# Altium schematic sheet IQ_Demod.SchDoc
size B; SheetNumber: 4; SheetTotal: 15
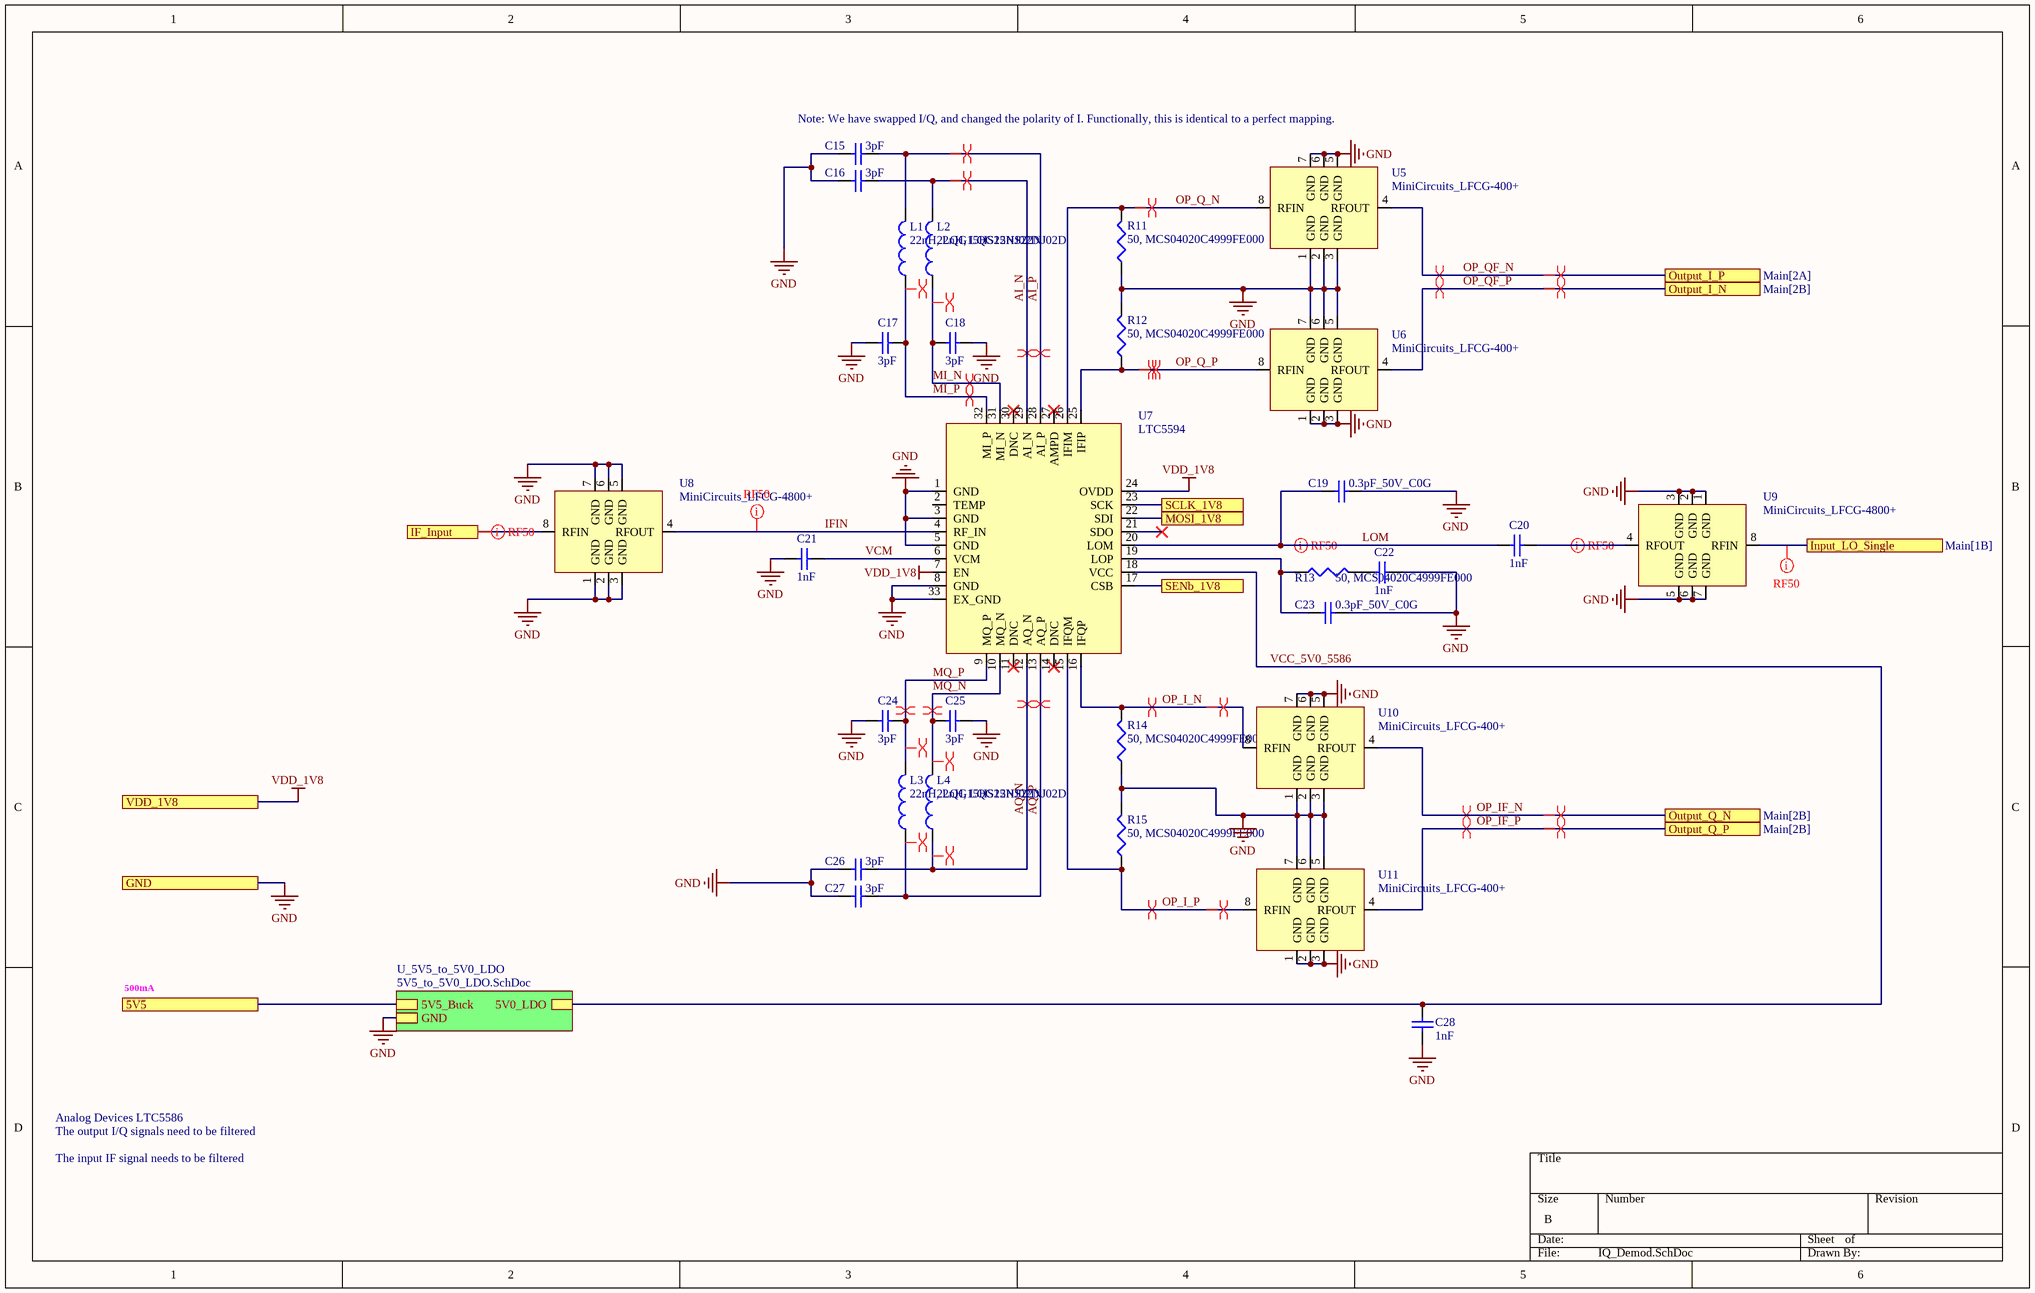
[diagram p0: IQ_Demod.SchDoc]

## Parts
C15  3pF  [Johanson-0201]
C16  3pF  [Johanson-0201]
C17  3pF  [Johanson-0201]
C18  3pF  [Johanson-0201]
C19  0.3pF_50V_C0G  [SMD-0402]
C20  1nF  [SMD-0402]
C21  1nF  [SMD-0402]
C22  1nF  [SMD-0402]
C23  0.3pF_50V_C0G  [SMD-0402]
C24  3pF  [Johanson-0201]
C25  3pF  [Johanson-0201]
C26  3pF  [Johanson-0201]
C27  3pF  [Johanson-0201]
C28  1nF  [SMD-0402]
L1  22nH, LQG15HS22NJ02D  [SMD-0402]
L2  22nH, LQG15HS22NJ02D  [SMD-0402]
L3  22nH, LQG15HS22NJ02D  [SMD-0402]
L4  22nH, LQG15HS22NJ02D  [SMD-0402]
R11  50, MCS04020C4999FE000  [SMD-0402]
R12  50, MCS04020C4999FE000  [SMD-0402]
R13  50, MCS04020C4999FE000  [SMD-0402]
R14  50, MCS04020C4999FE000  [SMD-0402]
R15  50, MCS04020C4999FE000  [SMD-0402]
U5  MiniCircuits_LFCG-400+  [MiniCircuits LFCG-1400+]
U6  MiniCircuits_LFCG-400+  [MiniCircuits LFCG-1400+]
U7  LTC5594  [LTC5594]
U8  MiniCircuits_LFCG-4800+  [MiniCircuits LFCG-1400+]
U9  MiniCircuits_LFCG-4800+  [MiniCircuits LFCG-1400+]
U10  MiniCircuits_LFCG-400+  [MiniCircuits LFCG-1400+]
U11  MiniCircuits_LFCG-400+  [MiniCircuits LFCG-1400+]

## Sub-sheets
U_5V5_to_5V0_LDO = 5V5_to_5V0_LDO.SchDoc: 5V5_Buck, GND, 5V0_LDO

## Ports
5V5 (see Main[1B], Buck_TPSM82913_5V5[5B]), GND (see Main[2B], 3V7_to_3V3_LDO[1B], 5V5_to_5V0_LDO[1C], Buck_TPSM82913_1V8[3C], Buck_TPSM82913_3V7[3C], Buck_TPSM82913_5V0[3C], Buck_TPSM82913_5V5[2C], Clocking_and_LO[2A], Fan_Interfaces[2B], IQ_Mod[1B], LMX2820[4D], Microzed_Interfaces[1A], Power_Supply[6B], Voltage_Conv_Bidirectional[1B]), IF_Input (see Main[1A]), Input_LO_Single (see Main[1B]), MOSI_1V8 (see Main[1B]), Output_I_N (see Main[2B]), Output_I_P (see Main[2A]), Output_Q_N (see Main[2B]), Output_Q_P (see Main[2B]), SCLK_1V8 (see Main[1B]), SENb_1V8 (see Main[1B]), VDD_1V8 (see Main[1B])

## Nets
GND: C15.1 C16.1 C17.1 C18.2 C19.2 C21.2 C22.1 C23.2 C24.1 C25.2 C26.1 C27.1 C28.2 R11.1 R12.2 R14.1 R15.2 U5.1(GND) U5.2(GND) U5.3(GND) U5.5(GND) U5.6(GND) U5.7(GND) U6.1(GND) U6.2(GND) U6.3(GND) U6.5(GND) U6.6(GND) U6.7(GND) U7.1(GND) U7.3(GND) U7.5(GND) U7.8(GND) U7.33(EX_GND) U8.1(GND) U8.2(GND) U8.3(GND) U8.5(GND) U8.6(GND) U8.7(GND) U9.1(GND) U9.2(GND) U9.3(GND) U9.5(GND) U9.6(GND) U9.7(GND) U10.1(GND) U10.2(GND) U10.3(GND) U10.5(GND) U10.6(GND) U10.7(GND) U11.1(GND) U11.2(GND) U11.3(GND) U11.5(GND) U11.6(GND) U11.7(GND) ; port GND, sheet U_5V5_to_5V0_LDO/GND
VDD_1V8: U7.7(EN) U7.24(OVDD) ; port VDD_1V8
5V5: port 5V5, sheet U_5V5_to_5V0_LDO/5V5_Buck
AI_N: C16.2 L2.2 U7.29(AI_N)
AI_P: C15.2 L1.2 U7.28(AI_P)
AQ_N: C26.2 L4.1 U7.12(AQ_N)
AQ_P: C27.2 L3.1 U7.13(AQ_P)
IF_Input: U8.8(RFIN) ; port IF_Input
IFIN: U7.4(RF_IN) U8.4(RFOUT)
Input_LO_Single: U9.8(RFIN) ; port Input_LO_Single
LOM: C19.1 C20.2 U7.20(LOM)
MI_N: C18.1 L2.1 U7.31(MI_N)
MI_P: C17.2 L1.1 U7.32(MI_P)
MOSI_1V8: U7.22(SDI) ; port MOSI_1V8
MQ_N: C25.1 L4.2 U7.10(MQ_N)
MQ_P: C24.2 L3.2 U7.9(MQ_P)
OP_I_N: R14.2 U7.16(IFQP) U10.8(RFIN)
OP_I_P: R15.1 U7.15(IFQM) U11.8(RFIN)
OP_IF_N: U10.4(RFOUT) ; port Output_Q_N
OP_IF_P: U11.4(RFOUT) ; port Output_Q_P
OP_Q_N: R11.2 U5.8(RFIN) U7.26(IFIM)
OP_Q_P: R12.1 U6.8(RFIN) U7.25(IFIP)
OP_QF_N: U5.4(RFOUT) ; port Output_I_P
OP_QF_P: U6.4(RFOUT) ; port Output_I_N
SCLK_1V8: U7.23(SCK) ; port SCLK_1V8
SENb_1V8: U7.17(CSB) ; port SENb_1V8
VCC_5V0_5586: C28.1 U7.18(VCC) ; sheet U_5V5_to_5V0_LDO/5V0_LDO
VCM: C21.1 U7.6(VCM)
NetC20_1: C20.1 U9.4(RFOUT)
NetC22_2: C22.2 R13.2
NetC23_1: C23.1 R13.1 U7.19(LOP)

Not connected (* = marked no-connect by the designer): U7 2(TEMP) 11(DNC)* 14(DNC)* 21(SDO)* 27(AMPD)* 30(DNC)*

## Layout directives
net class RF50: IF_Input, IFIN, Input_LO_Single, LOM, NetC20_1
differential pair: AI_N, AI_P, AQ_N, AQ_P, MI_N, MI_P, MQ_N, MQ_P
differential pair; differential pair class DEMOD_OUT: OP_I_N, OP_I_P, OP_IF_N, OP_IF_P, OP_Q_N, OP_Q_P, OP_QF_N, OP_QF_P
net class DIFF_100: AI_N, AI_P, AQ_N, AQ_P, MI_N, MI_P, MQ_N, MQ_P, OP_I_N, OP_I_P, OP_IF_N, OP_IF_P, OP_Q_N, OP_Q_P, OP_QF_N, OP_QF_P

## Notes on the sheet
- Note: We have swapped I/Q, and changed the polarity of I. Functionally, this is identical to a perfect mapping.
- 500mA
- Analog Devices LTC5586
- The output I/Q signals need to be filtered
- The input IF signal needs to be filtered

## Library data of the parts
C15-C18 C24-C27 = CAP0201: Capacitor 0201 Imperial
C19-C23 C28 = CAP0402: Ceramic Capacitor 0402
L1-L4 = L0402: Inductor 0402
R11-R15 = RES0402: Resistor-0402
U5 U6 U10 U11 = MiniCircuits_LFCG-400+: DC-530MHz LPF
U8 U9 = MiniCircuits_LFCG-1400+